# EAGLE design FrequencyProbe (EAGLE 7.6.0)
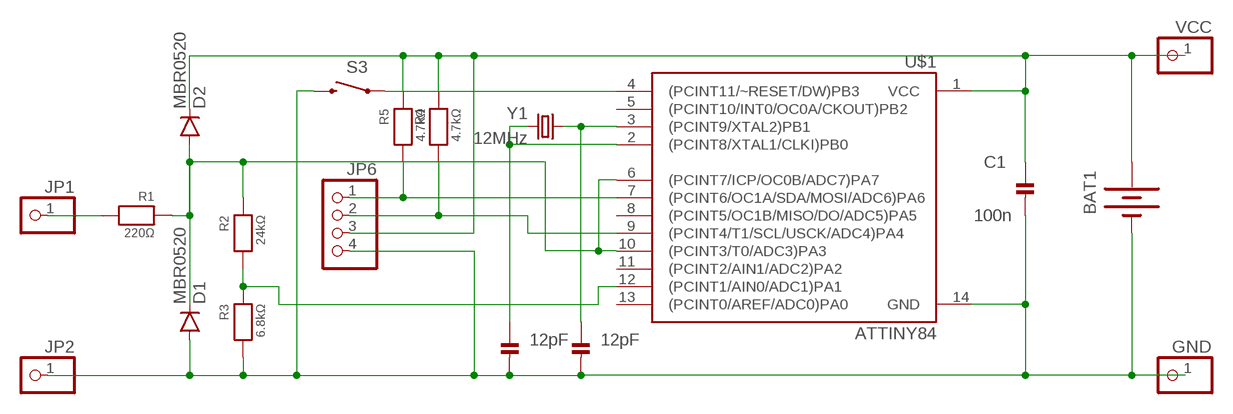
[diagram p0: schematic, sheet 1]

## Parts
BAT1  BATTERY12MM  [BATTCON_12MM]
C1  100n  CAP_CERAMIC_0805MP  [_0805MP]
C12  12pF  CAP_CERAMIC_0805MP  [_0805MP]
C13  12pF  CAP_CERAMIC_0805MP  [_0805MP]
D1  MBR0520  DIODESOD123  [SOD-123]
D2  MBR0520  DIODESOD123  [SOD-123]
GND  PINHD-1X1CB  [1X01-CLEANBIG]
JP1  PINHD-1X1CB  [1X01-CLEANBIG]
JP2  PINHD-1X1CB  [1X01-CLEANBIG]
JP6  HEADER-1X4ROUND  [1X04_ROUND]
R1  220Ω  RESISTOR_0805MP  [_0805MP]
R2  24kΩ  RESISTOR_0805MP  [_0805MP]
R3  6.8kΩ  RESISTOR_0805MP  [_0805MP]
R4  4.7kΩ  RESISTOR_0805MP  [_0805MP]
R5  4.7kΩ  RESISTOR_0805MP  [_0805MP]
S3  SWITCH-MOMENTARY-2SMD  [TACTILE-SWITCH-SMD]
U$1  ATTINY84  [SO14]
VCC  PINHD-1X1CB  [1X01-CLEANBIG]
Y1  12MHz  CRYSTALCRYSTAL-SMD-5X3-12MHZ  [CRYSTAL-SMD-5X3]

## Nets
GND: BAT1.GND(-) C1.2 C12.2 C13.2 D1.A GND.1 JP2.1 JP6.4 R3.2 S3.3 U$1.14(GND)
N$1: JP6.2 R4.2 U$1.9((PCINT4/T1/SCL/USCK/ADC4)PA4)
N$2: JP6.1 R5.2 U$1.7((PCINT6/OC1A/SDA/MOSI/ADC6)PA6)
N$3: D1.C D2.A R1.1 R2.1 U$1.6((PCINT7/ICP/OC0B/ADC7)PA7) U$1.10((PCINT3/T0/ADC3)PA3)
N$4: C12.1 U$1.3((PCINT9/XTAL2)PB1) Y1.1
N$5: S3.1 U$1.4((PCINT11/~RESET/DW)PB3)
N$6: C13.1 U$1.2((PCINT8/XTAL1/CLKI)PB0) Y1.3
N$7: R2.2 R3.1 U$1.12((PCINT1/AIN0/ADC1)PA1)
N$8: JP1.1 R1.2
VCC: BAT1.PWR@1(+) C1.1 D2.C JP6.3 R4.1 R5.1 U$1.1(VCC) VCC.1
Unconnected: U$1.5((PCINT10/INT0/OC0A/CKOUT)PB2) U$1.8((PCINT5/OC1B/MISO/DO/ADC5)PA5) U$1.11((PCINT2/AIN1/ADC2)PA2) U$1.13((PCINT0/AREF/ADC0)PA0)

## Library data of the parts
BAT1 = SparkFun-Electromechanical:BATTERY: Battery Holders Various common sizes : AA, AAA, 18650 (PRT-12895), 20mm coin cell and 12mm coin cell. 20MM_4LEGS, BATT-10373; PROD_ID: BATT-08044
C1 C12 C13 = microbuilder:CAP_CERAMIC: Ceramic Capacitors 0402 - 0402 Surface Mount Capacitors 16pF 50V 5% [Digikey: 445-4899-2-ND] 18pF 50V 5% [Digikey: 490-1281-2-ND] 22pF 50V 5% [Digikey: 490-1283-2-ND] 68pF 50V 5% [Digikey: 490-1289-2-ND] 0.1uF 10V 10% [Digikey: 490-1318-2-ND] 1.0uF 6.3V 10% [Digikey: 490-1320-2-ND] 0603 - 0603 Surface Mount Capacitors 16 pF 50V 5% [Digikey: 445-5051-2-ND] 22 pF 50V [Digikey: PCC220ACVTR-ND] 33 pF 50V 5% [Digikey: 490-1415-1-ND] 56pF 50V 5% [Digikey: 490-1421-1-ND] 220pF 50V 5% [Digikey: 445-1285-1-ND] 680 pF 50V 2200 pF 50V 5% C0G [Digikey: 445-1297-1-ND] 5600 pF 100V 5% X7R [Digikey: 478-3711-1-ND] 0.1 µF 25V 10% [Digikey: PCC2277TR-ND] 0.22 µF 16V 10% X7R [Digikey: 445-1318-1-ND] 1.0 µF 25V 10% [Digikey: 445-5146-2-ND] 0603 - RF Specific 3pF 250V +/-0.1pF RF [Digikey: 712-1347-1-ND] 18 pF 250V 5% [Digikey: 478-3505-1-ND or 712-1322-1-ND] 56 pF 250V 5% C0G RF [Digikey: 490-4867-1-ND] 68 pF 250V RF [Digikey: 490-4868-1-ND] 0805 - 0805 Surface Mount Capacitors 220 pF 250V 2% RF Ceramic Capacitor [Digikey: 712-1398-1-ND] 1000 pF 50V 2% NP0 Ceramic Capacitor [Digikey: 478-3760-1-ND] 0.1 µF 25V 10% Ceramic Capacitor [Digikey: PCC1828TR-ND] 1.0 µF 16V 10% Ceramic Capacitor[Digikey: 490-1691-2-ND] 10.0 µF 10V 10% Ceramic Capacitor[Digikey: 709-1228-1-ND] 10.0 uF 16V 10% Ceramic Capacitor [Digikey: 478-5165-2-ND] 47 uF 6.3V 20% Ceramic Capacitor [Digikey: 587-1779-1-ND or 399-5506-1-ND] 1206 - 1206 Surface Mount Capacitors 47uF 10V 20% Ceramic Capacitor [Digikey: 490-5528-1-ND or 399-5508-1-ND or 445-6010-1-ND] 100uF 6.3V -20%, +80% Y5V Ceramic Capacitor (Digikey: 490-4512-1-ND, Mouser: 81-GRM31CF50J107ZE1L)
D1 D2 = SparkFun-DiscreteSemi:DIODE: Diode These are standard reverse protection diodes and small signal diodes. SMA package can handle up to about 1A. SOD-323 can handle about 200mA. What the SOD-323 package when ordering, there are some mfgs out there that are 5-pin packages.
GND JP1 JP2 VCC = adafruit:PINHD-1X1: Pin header 1x1 for 0.1" spacing With round pins
JP6 = microbuilder:HEADER-1X4: PIN HEADER
R1-R5 = microbuilder:RESISTOR: Resistors 0402 - 0402 Surface Mount Package 22 Ohm 1% 1/16W [Digikey: 311-22.0LRTR-ND] 33 Ohm 5% 1/16W 1.0K 5% 1/16W 1.5K 5% 1/16W 2.0K 1% 1/16W 10.0K 1% 1/16W [Digikey: 311-10.0KLRTR-ND] 10.0K 5% 1/16W [Digikey: RMCF0402JT10K0TR-ND] 12.1K 1% 1/16W [Digikey: 311-22.0LRTR-ND] 100.0K 5% 1/16W 0603 - 0603 Surface Mount Package 0 Ohm 1/10 Watt 1% Resistor 15 Ohm 1/10 Watt 1% Resistor 33 Ohm 1/10 Watt 1% Resistor 49.9 Ohm 1/10 Watt 1% Resistor 100 Ohm 1/10 Watt 1% Resistor 150 Ohm 1/10 Watt 1% Resistor 240 Ohm 1/10 Watt 1% Resistor 390 Ohm 1/10 Watt 1% Resistor 560 Ohm 1/10 Watt 1% Resistor 680 Ohm 1/10 Watt 1% Resistor 750 Ohm 1/10 Watt 1% Resistor 1.0K Ohm 1/10 Watt 1% Resistor 1.5K Ohm 1/10 Watt 1% Resistor 2.0K Ohm 1/10 Watt 1% Resistor 2.2K Ohm 1/10 Watt 1% Resistor 3.3K Ohm 1/10 Watt 1% Resistor 4.7K Ohm 1/10 Watt 1% Resistor 10.0K Ohm 1/10 Watt 1% Resistor 12.0K Ohm 1/10 Watt 1% Resistor 12.1K Ohm 1/10 Watt 1% Resistor 20.0K Ohm 1/10 Watt 1% Resistor 33.0K Ohm 1/10 Watt 1% Resistor 100.0K Ohm 1/10 Watt 1% Resistor 0805 - 0805 Surface Mount Package 0 Ohm 1/8 Watt 1% Resistor 33 Ohm 1/8 Watt 1% Resistor 100 Ohm 1/8 Watt 1% Resistor 150 Ohm 1/8 Watt 1% Resistor 200 Ohm 1/8 Watt 1% Resistor 240 Ohm 1/8 Watt 1% Resistor 330 Ohm 1/8 Watt 1% Resistor 390 Ohm 1/8 Watt 1% Resistor 470 Ohm 1/8 Watt 1% Resistor 1.0K Ohm 1/8 Watt 1% Resistor 1.5K Ohm 1/8 Watt 1% Resistor 2.0K Ohm 1/8 Watt 1% Resistor 4.7K Ohm 1/8 Watt 1% Resistor 5.1K Ohm 1/8 Watt 1% Resistor 5.6K Ohm 1/8 Watt 1% Resistor 10.0K Ohm 1/8 Watt 1% Resistor 22.0K Ohm 1/8 Watt 1% Resistor 33.0K Ohm 1/8 Watt 1% Resistor 100K Ohm 1/8 Watt 1% Resistor 1206 - 1206 Surface Mount Package 2012 - 2010 Surface Mount Package 0.11 Ohm 1/2 Watt 1% Resistor - Digikey: RHM.11UCT-ND
S3 = SparkFun-Electromechanical:SWITCH-MOMENTARY-2: Various NO switches- pushbuttons, reed, etc; PROD_ID: SWCH-08247
U$1 = SparkFun-DigitalIC:ATTINY84: Atmel 14-pin 2/4/8kB flash uC; PROD_ID: IC-11285
Y1 = SparkFun-FreqCtrl:CRYSTAL: Various standard crystals. Proven footprints.; PROD_ID: XTAL-08297

## Board
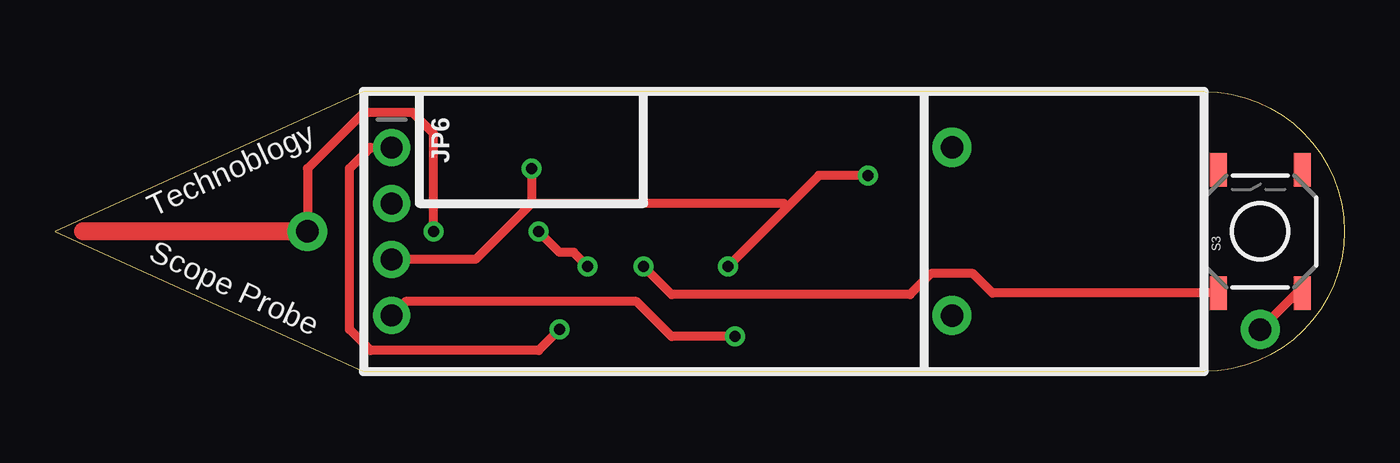
[diagram p1: board, top side]
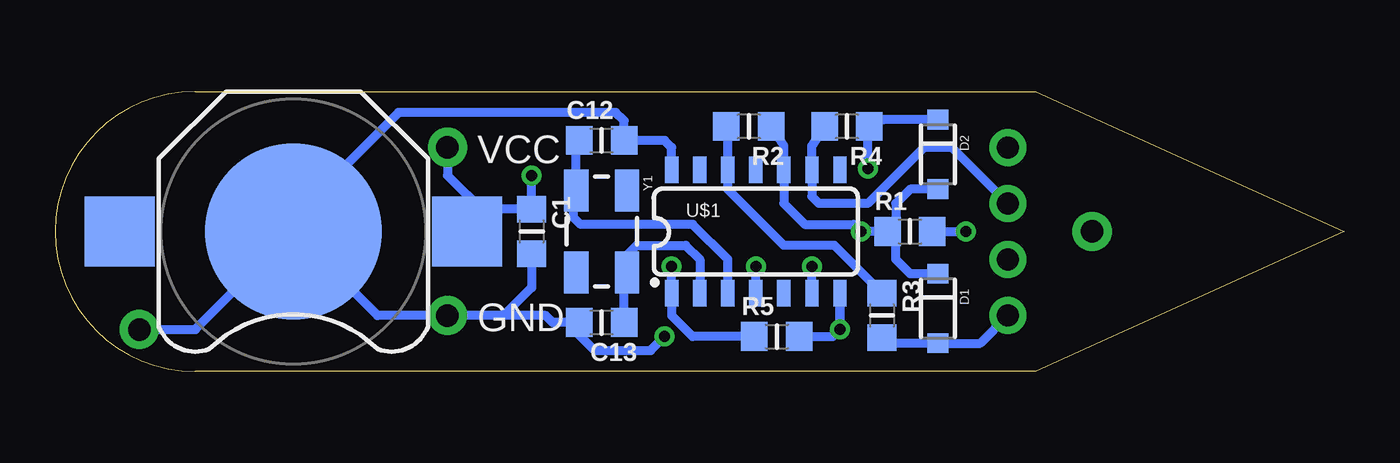
[diagram p2: board, bottom side, seen from below]

Size 58.42 x 12.7 mm. Coordinates in mm from the lower left corner, seen from the top.
Outline: 13.97,0 52.07,0 arc180 52.07,12.7 13.97,12.7 0,6.35 13.97,0
Copper layers (1*16): Top 0.035mm / dielectric 1.5mm / Bottom 0.035mm
Design rules "default *": minimum track width 10mil, minimum drill 24mil, track to track 8mil, track to pad 8mil, pad to pad 8mil, via to via 8mil, smd to smd 8mil, copper to edge 40mil, drill to drill 8mil, minimum pad ring 10mil, minimum via ring 8mil, stop-mask expansion 4mil, vias tented up to drill 20mil, thermal gap 10mil

### Footprints (pad centres in the part's own frame; a part is rotated, then mirrored left to right if it is on the bottom)
BATTCON_12MM = smd 8 x 8: GND 0,0 | smd 3.175 x 3.175: PWR@1 -7.874,0; PWR@2 7.874,0
_0805MP = smd 1.2 x 1.3: 1 -1.016,0; 2 1.016,0
SOD-123 = smd 0.9 x 0.95: A 1.575,0; C -1.575,0
1X01-CLEANBIG = drill 1.016 pad 1.778: 1 0,0
1X04_ROUND = drill 1 pad 1.676: 1 -3.81,0; 2 -1.27,0; 3 1.27,0; 4 3.81,0
TACTILE-SWITCH-SMD = smd 1.524 x 0.762: 1 -2.794,1.905; 2 2.794,1.905; 3 -2.794,-1.905; 4 2.794,-1.905
SO14 = smd 0.6 x 1.2: 1 -3.81,-2.8; 2 -2.54,-2.8; 3 -1.27,-2.8; 4 0,-2.8; 5 1.27,-2.8; 6 2.54,-2.8; 7 3.81,-2.8; 8 3.81,2.8; 9 2.54,2.8; 10 1.27,2.8; 11 0,2.8; 12 -1.27,2.8; 13 -2.54,2.8; 14 -3.81,2.8
CRYSTAL-SMD-5X3 = smd 1.9 x 1.1: 1 -1.85,-1.15; 2 1.85,-1.15; 3 1.85,1.15; 4 -1.85,1.15

### Placement (x,y rotation side)
BAT1  47.62,6.35 180 bottom
C1  36.83,6.35 270 bottom
C12  33.66,10.48 0 bottom
C13  33.66,2.22 180 bottom
D1  18.41,2.86 270 bottom
D2  18.41,9.84 270 bottom
GND  40.64,2.54 0 top
JP1  11.43,6.35 0 top
JP2  54.61,1.91 0 top
JP6  15.24,6.35 270 top
R1  19.68,6.35 0 bottom
R2  26.99,11.11 180 bottom
R3  20.95,2.54 270 bottom
R4  22.54,11.11 180 bottom
R5  25.72,1.59 0 bottom
S3  54.61,6.35 90 top
U$1  26.67,6.35 0 bottom
VCC  40.64,10.16 0 top
Y1  33.66,6.35 270 bottom

### Tracks (layer width: path | path; a pad name or v marks a point on that pad's centre or on a via)
GND  (via drill 0.5)
  Top 0.406: S3.3 56.26,3.56 JP2.1 | JP6.4 15.88,3.17 26.35,3.17 27.94,1.59 v30.8,1.59
  Bottom 0.406: U$1.14 30.48,10.16 30.8,10.48 C12.2 32.64,11.37 33.02,11.75 42.86,11.75 45.72,8.89 45.72,8.26 BAT1.GND | JP6.4 16.5,1.28 D1.A 20.95,1.28 R3.2 | JP2.1 52.07,1.91 BAT1.GND | BAT1.GND 43.81,2.54 GND.1 38.1,2.54 | v30.8,1.59 31.43,0.95 33.97,0.95 34.92,1.91 C13.2 35.88,2.22 36.2,2.54 38.1,2.54 | C1.2 36.83,3.81 38.1,2.54
N$1
  Bottom 0.406: JP6.2 17.78,10.16 19.05,10.16 21.59,7.62 23.81,7.62 24.13,7.94 U$1.9 24.13,10.22 R4.2
N$2  (via drill 0.5)
  Top 0.406: v22.86,1.91 21.91,0.95 14.29,0.95 13.34,1.91 13.34,9.21 14.29,10.16 JP6.1
  Bottom 0.406: 22.86,2.16 U$1.7 v22.86,1.91 23.18,1.59 R5.2
N$3  (via drill 0.5)
  Top 0.406: v24.13,4.76 23.5,5.4 22.86,5.4 v21.91,6.35
  Bottom 0.406: R2.1 25.4,10.22 U$1.10 25.4,7.62 24.45,6.67 22.23,6.67 v21.91,6.35 R1.1 | D2.A 19.67,8.27 20.32,7.62 20.32,6.73 R1.1 | D1.C 19.67,4.43 20.32,5.08 20.32,5.97 R1.1 | U$1.6 v24.13,4.76
N$4
  Bottom 0.406: C12.1 34.8,10.49 Y1.1 34.92,8.08 34.92,6.99 34.61,6.67 29.53,6.67 27.94,5.08 U$1.3
N$5  (via drill 0.5)
  Top 0.406: S3.1 42.48,3.56 41.59,4.45 39.69,4.45 38.73,3.49 27.94,3.49 v26.67,4.76
  Bottom 0.406: U$1.4 v26.67,4.76
N$6
  Bottom 0.406: Y1.3 32.8,4.5 | 32.8,4.2 Y1.3 | U$1.2 29.21,5.08 29.84,5.71 32.07,5.71 32.51,5.28 Y1.3 | C13.1 32.64,4.37 Y1.3
N$7
  Bottom 0.406: R3.1 23.11,5.71 25.4,5.71 27.94,8.26 U$1.12 27.94,11.18 R2.2
N$8  (via drill 0.5)
  Top 0.406: v17.14,6.35 17.14,10.79 16.19,11.75 13.97,11.75 11.43,9.21 JP1.1
  Top 0.813: JP1.1 1.27,6.35
  Bottom 0.406: R1.2 v17.14,6.35
VCC  (via drill 0.5)
  Top 0.406: JP6.3 19.05,5.08 21.59,7.62 | 33.18,7.46 34.61,8.89 v36.83,8.89 | 33.18,7.46 v30.48,4.76 | v21.59,9.21 21.59,7.62 | 21.59,7.62 33.02,7.62 33.18,7.46
  Bottom 0.406: v36.83,8.89 C1.1 38.73,7.37 38.92,7.18 | 38.92,7.18 BAT1.PWR@1 | VCC.1 40.64,8.89 38.92,7.18 | v21.59,9.21 21.59,11.18 R4.1 20.9,11.42 D2.C | R5.1 29.53,1.59 30.48,2.54 U$1.1 v30.48,4.76

### Text on the board
tPlace: Technoblogy | Scope Probe